# Altium schematic sheet PAGE2-Incubator_HUZZAH32.SchDoc
size A3
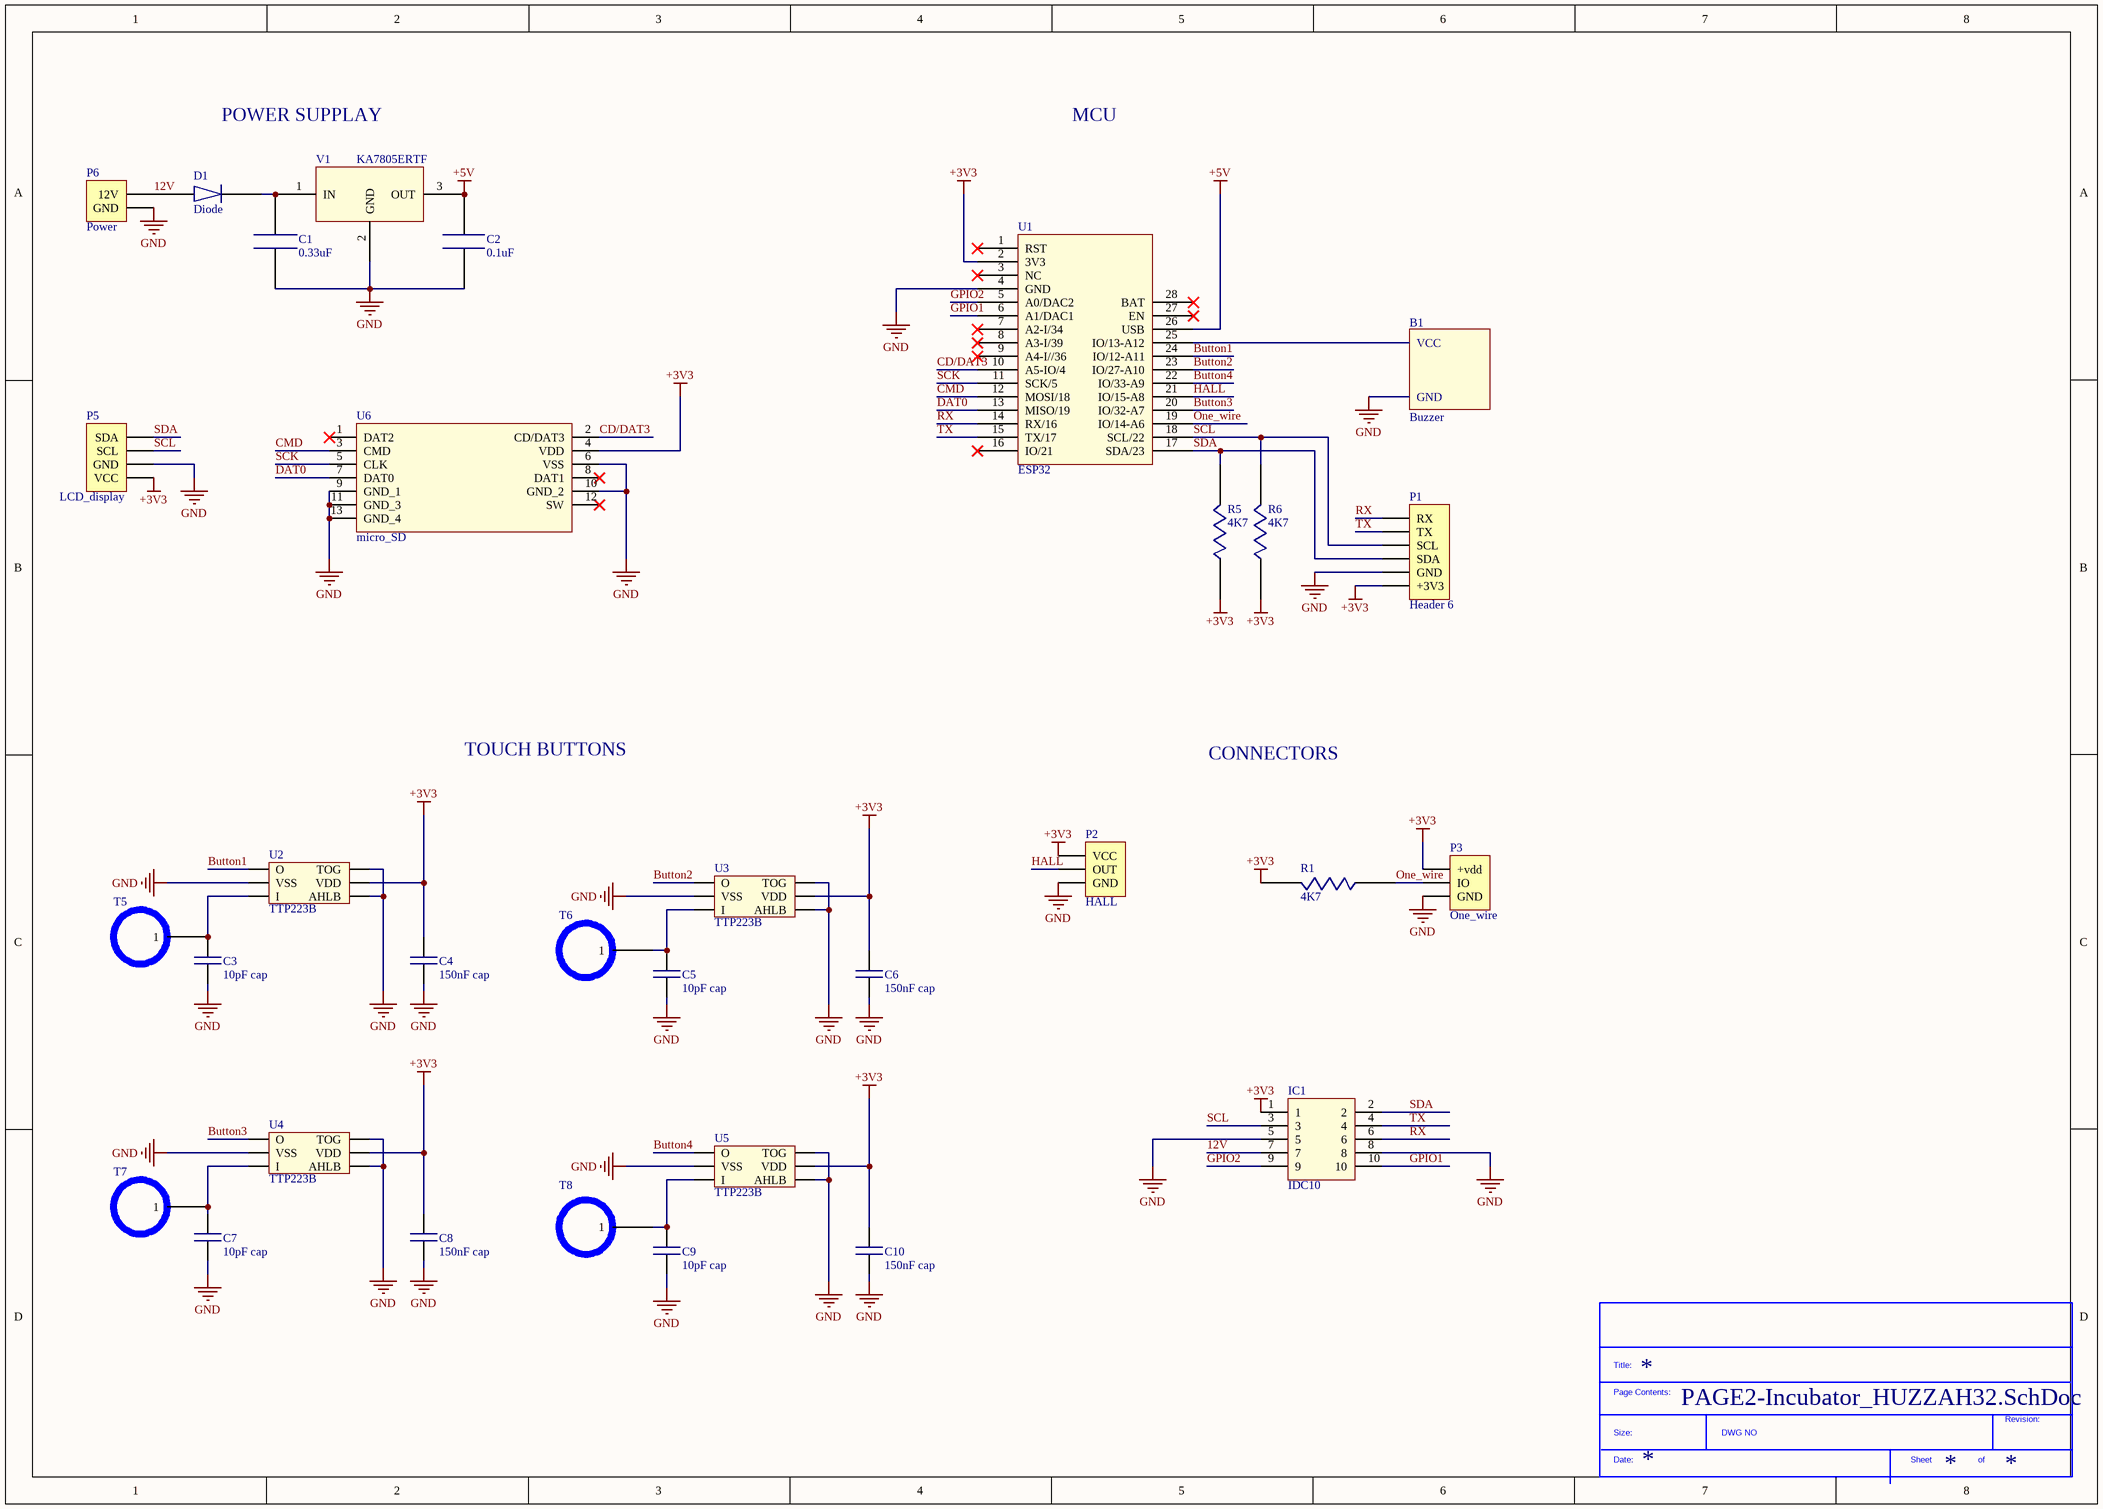
[diagram p0: PAGE2-Incubator_HUZZAH32.SchDoc]

## Parts
*?  SDTitleBlock  (value not drawn)  (graphical)
B1  Buzzer  [Buzzer]
C1  0.33uF  [CAP0603]
C2  0.1uF  [CAP0603]
C3  10pF cap  [CAP0603]
C4  150nF cap  [CAP0603]
C5  10pF cap  [CAP0603]
C6  150nF cap  [CAP0603]
C7  10pF cap  [CAP0603]
C8  150nF cap  [CAP0603]
C9  10pF cap  [CAP0603]
C10  150nF cap  [CAP0603]
D1  Diode  [SODFL350X110-2N]
IC1  IDC10  [IDC10]
P1  Header 6  [HDR1X6]
P2  HALL  [HDR1X3]
P3  One_wire  [HDR1X3]
P5  LCD_display  [LCD_display]
P6  Power  [HDR1X2]
R1  4K7  [RES0603]
R5  4K7  [RES0603]
R6  4K7  [RES0603]
T5  Touch button  [Touch_Button]  (value not drawn)
T6  Touch button  [Touch_Button]  (value not drawn)
T7  Touch button  [Touch_Button]  (value not drawn)
T8  Touch button  [Touch_Button]  (value not drawn)
U1  ESP32  [ESP32]
U2  TTP223B  [TTP223]
U3  TTP223B  [TTP223]
U4  TTP223B  [TTP223]
U5  TTP223B  [TTP223]
U6  micro_SD  [micro_SD]
V1  KA7805ERTF  [DPAK248P950X240-3N]

## Nets
+3V3: C4.2 C6.2 C8.2 C10.2 IC1.1 P1.6(+3V3) P2.1(VCC) P3.1(+vdd) P5.1(VCC) R1.2 R5.1 R6.1 U1.2(3V3) U2.5(VDD) U3.5(VDD) U4.5(VDD) U5.5(VDD) U6.4(VDD)
+5V: C2.2 U1.26(USB) V1.3(OUT)
GND: B1.2(GND) C1.1 C2.1 C3.1 C4.1 C5.1 C6.1 C7.1 C8.1 C9.1 C10.1 IC1.5 IC1.8 P1.5(GND) P2.3(GND) P3.3(GND) P5.2(GND) P6.1(GND) U1.4(GND) U2.2(VSS) U2.4(AHLB) U2.6(TOG) U3.2(VSS) U3.4(AHLB) U3.6(TOG) U4.2(VSS) U4.4(AHLB) U4.6(TOG) U5.2(VSS) U5.4(AHLB) U5.6(TOG) U6.6(VSS) U6.9(GND_1) U6.10(GND_2) U6.11(GND_3) U6.13(GND_4) V1.2(GND)
12V: D1.2 IC1.7 P6.2(12V)
Button1: U1.24(IO/12-A11) U2.1(O)
Button2: U1.23(IO/27-A10) U3.1(O)
Button3: U1.20(IO/32-A7) U4.1(O)
Button4: U1.22(IO/33-A9) U5.1(O)
CD/DAT3: U1.10(A5-IO/4) U6.2(CD/DAT3)
CMD: U1.12(MOSI/18) U6.3(CMD)
DAT0: U1.13(MISO/19) U6.7(DAT0)
GPIO1: IC1.10 U1.6(A1/DAC1)
GPIO2: IC1.9 U1.5(A0/DAC2)
HALL: P2.2(OUT) U1.21(IO/15-A8)
One_wire: P3.2(IO) R1.1 U1.19(IO/14-A6)
RX: IC1.6 P1.1(RX) U1.14(RX/16)
SCK: U1.11(SCK/5) U6.5(CLK)
SCL: IC1.3 P1.3(SCL) P5.3(SCL) R6.2 U1.18(SCL/22)
SDA: IC1.2 P1.4(SDA) P5.4(SDA) R5.2 U1.17(SDA/23)
TX: IC1.4 P1.2(TX) U1.15(TX/17)
NetB1_1: B1.1(VCC) U1.25(IO/13-A12)
NetC1_2: C1.2 D1.1 V1.1(IN)
NetC3_2: C3.2 T5.1 U2.3(I)
NetC5_2: C5.2 T6.1 U3.3(I)
NetC7_2: C7.2 T7.1 U4.3(I)
NetC9_2: C9.2 T8.1 U5.3(I)

Not connected (* = marked no-connect by the designer): U1 1(RST)* 3(NC)* 7(A2-I/34)* 8(A3-I/39)* 9(A4-I//36)* 16(IO/21)* 27(EN)* 28(BAT)*; U6 1(DAT2)* 8(DAT1)* 12(SW)*

## Notes on the sheet
- POWER SUPPLAY
- MCU
- TOUCH BUTTONS
- CONNECTORS
- (in symbol SDTitleBlock) Title:; Page Contents:; Revision:; Size:; DWG NO; Date:; Sheet; of

## Library data of the parts
B1 = Buzzer: MULTICOMP         MCABT-458-RC            SOUNDER, 75DB, 1-25V, SMD; Supply Voltage Min: 1V; Supply Voltage Max: 25V; Tones: Single; Current Rating: 1mA; Resonant Frequency: 4kHz; SVHC: No SVHC (15-Jun-2015); Supplier 1: Farnell; Manufacturer: Multicomp; Manufacturer Part Number: MCABT-458-RC; Stock 1: 2929; Pricing 1: 1=1.84, 3=1.67, 5=1.53, 10=1.44, 20=1.18, 50=1.16, 250=1.13 (EUR); Sound Level SPL: 75dB; Transducer Function: Sounder; Transducer Mounting: SMD; Product Range: -; ComponentLink1URL: http://www.farnell.com/datasheets/1860703.pdf; ComponentLink1Description: http://www.farnell.com/datasheets/1860703.pdf
C1 = 0.33uF: 0.33µF ±10% 50V X7R Ceramic Capacitor -55°C ~ 125°C Surface Mount, MLCC 0603 (1608 Metric) 0.063" L x 0.031" W (1.60mm x 0.80mm); Manufacturer: TDK; Manufacturer Part Number: C1608X7R1H334K080AC; PCN Part Number: MLCC Part Number Change 30/Nov/2012; Product Training Modules: C Series General Applications SEAT, CCV, and TVCL Design Tools Guide to Replacing an Electrolytic Capacitor with an MLCC; Catalog Drawings: C SERIES_0603_0.95; Design Resources: 20 W Non-Isolated Buck LED Driver Using PL LNK460KG; EDA / CAD Models: Download from Accelerated Designs; Online Catalog: C Series, General Purpose; Other Names: 445-5950-6; Supplier 1: Farnell; Stock 1: 46003; Pricing 1: 10=0.405, 100=0.221, 500=0.152, 1000=0.116 (EUR); RoHS Information: RoHS Certificate-MLCC; Standard Package: 1; Category: Capacitors; Family: Ceramic Capacitors; Series: C; Packaging: Digi-Reel®; Capacitance: 0.33µF; Tolerance: ±10%; Voltage - Rated: 50V; Temperature Coefficient: X7R; Mounting Type: Surface Mount, MLCC; Operating Temperature: -55°C ~ 125°C; Applications: General Purpose; Package / Case: 0603 (1608 Metric); Size / Dimension: 0.063" L x 0.031" W (1.60mm x 0.80mm); Thickness (Max): 0.037" (0.95mm); Supplier Part Number 1: 2346907
C2 = 0.1uF: CAP CER 0.1UF 50V X7R 0603; Manufacturer: KEMET; Manufacturer Part Number: C0603C104J5RACAUTO; Capacitance: .1uF; Tolerance (+ or -): 5%; Voltage: 50VDC; Case Style: Ceramic Chip; Wire Form: Not Required; Product Length (mm): 1.6mm; Product Depth (mm): 0.8mm; Product Diameter (mm): Not Requiredmm; Supplier 1: Farnell; Stock 1: 0; Package / Case: 0603; Packaging: Tape and Reel; Supplier Part Number 1: 2478241; Temp Coeff (Dielectric): X7R; Operating Temp Range: -55C to 125C; Mounting Style: Surface Mount; Construction: SMT Chip; Failure Rate: Not Required; Product Height (mm): 0.8mm
C3 C5 C7 C9 = 10pF: Cap Ceramic 10pF 50V X7R 10% SMD 0603 125C T/R; Manufacturer: Kyocera AVX; Manufacturer Part Number: 06035C100KAT2A; Supplier 1: Farnell; Stock 1: 0; Capacitance: 10 pF; Case Size/Dimension: 0603; Dielectric: X7R; Tolerance (%): ±10 %; Rated Voltage: 50 V; Supplier Part Number 1: 2332633
C4 C6 C8 C10 = 150nF: Manufacturer: KEMET; Manufacturer Part Number: C0603C154K5RACAUTO; Capacitance: .15uF; Tolerance (+ or -): 10%; Voltage: 50VDC; Temp Coeff (Dielectric): X7R; Case Style: Ceramic Chip; Wire Form: Not Required; Product Length (mm): 1.6mm; Product Depth (mm): 0.8mm; Product Diameter (mm): Not Requiredmm; Supplier 1: Farnell; Supplier Part Number 1: 2821222; Stock 1: 3690; Pricing 1: 10=0.125, 100=0.0664, 500=0.0489, 1000=0.041 (EUR); Operating Temp Range: -55C to 125C; Mounting Style: Surface Mount; Package / Case: 0603; Construction: SMT Chip; Failure Rate: Not Required; Product Height (mm): 0.8mm; Packaging: Tape and Reel
D1 = 20V,1A, SOD-123: NXP         PMEG2010ER             Schottky Rectifier, Single, 20 V, 1 A, SOD-123W, 2 Pins, 340 mV; Manufacturer: NXP Semiconductors; Maximum Continuous Forward Current: 1A; Number of Elements per Chip: 1; Peak Reverse Repetitive Voltage: 20V; Peak Forward Voltage: 340mV; Peak Reverse Current: 1mA; Supplier 1: Farnell; Manufacturer Part Number: PMEG2010ER; Stock 1: 5091; Pricing 1: 5=0.314, 25=0.196, 100=0.147, 250=0.141, 500=0.0849, 1000=0.075, 5000=0.0735 (EUR); Diode Configuration: Single; Mounting Type: Surface Mount; Package Type: SOD-123; Diode Type: Schottky; Pin Count: 2; Length: 2.8mm; Width: 1.9mm; Height: 1.1mm; Dimensions: 2.8 x 1.9 x 1.1mm; Maximum Operating Temperature: +150 °C; Minimum Operating Temperature: -55 °C; ComponentLink1URL: https://datasheet.ciiva.com/5727/1760771-5727088.pdf; ComponentLink1Description: https://datasheet.ciiva.com/5727/1760771-5727088.pdf; ComponentLink2URL: https://datasheet.ciiva.com/22696/1383341-22696483.pdf; ComponentLink2Description: https://datasheet.ciiva.com/22696/1383341-22696483.pdf; ComponentLink3URL: https://datasheet.ciiva.com/7965/1383341-7965062.pdf; ComponentLink3Description: https://datasheet.ciiva.com/7965/1383341-7965062.pdf; Supplier Part Number 1: 1907681
IC1 = IDC10: BOX HEADER 2.54MM MALE STR 10POS; Manufacturer: Wurth Electronics; Manufacturer Part Number: 61201021621; Number of Positions: 10 Position; Mounting Angle: Horizontal; Current Rating: 3 A; Insulation Resistance: 1000 MOhms; Voltage Rating: 250 V; Supplier 1: Farnell; Stock 1: 0; Product Category: Headers & Wire Housings; RoHS: True; Product: Headers; Type: Shrouded; Pitch: 2.54 mm; Number of Rows: 2 Row; Mounting Style: Through Hole; Termination Style: Solder; Contact Gender: Pin (Male); Contact Plating: Gold; Series: WR-BHD; Application: Wire-to-Board; Brand: Wurth Electronics; Contact Material: Copper Alloy; Flammability Rating: UL 94 V-0; Housing Material: Polybutylene Terephthalate (PBT); Operating Temperature Range: - 40 C to + 125 C; Packaging: Tray; ComponentLink1URL: https://datasheet.ciiva.com/731/6120xx21621-731344.pdf; ComponentLink1Description: https://datasheet.ciiva.com/731/6120xx21621-731344.pdf; ComponentLink2URL: https://datasheet.ciiva.com/15395/6120xx21621-265834-15395106.pdf; ComponentLink2Description: https://datasheet.ciiva.com/15395/6120xx21621-265834-15395106.pdf; ComponentLink3URL: https://datasheet.ciiva.com/7648/76595-7648121.pdf; ComponentLink3Description: https://datasheet.ciiva.com/7648/76595-7648121.pdf; Supplier Part Number 1: 1642019
P1 = Header 6: Header, 6-Pin; LatestRevisionDate: 17-Jul-2002; LatestRevisionNote: Re-released for DXP Platform.; Publisher: Altium Limited
P2 P3 = Header 3: Header, 3-Pin; LatestRevisionDate: 17-Jul-2002; LatestRevisionNote: Re-released for DXP Platform.; Publisher: Altium Limited
P5 = Header 4: Header, 4-Pin; LatestRevisionDate: 17-Jul-2002; LatestRevisionNote: Re-released for DXP Platform.; Publisher: Altium Limited
P6 = Header 2: Header, 2-Pin; LatestRevisionDate: 17-Jul-2002; LatestRevisionNote: Re-released for DXP Platform.; Publisher: Altium Limited
R1 R5 R6 = 4K7: Res Thick Film 0603 4.7K Ohm 1% 0.1W(1/10W) ±100ppm/C Molded SMD Automotive T/R; Manufacturer: Panasonic; Manufacturer Part Number: ERJ-3EKF4701V; Resistance: 4.7 kOhms; Power Rating: 100 mW; Voltage Rating: 75 V; Qualification: AEC-Q200; Unit Weight: 0.000071 oz; Supplier 1: Farnell; Stock 1: 3193; Pricing 1: 10=0.0347, 100=0.0206, 500=0.0159, 1000=0.0142 (GBP); Product Category: Thick Film Resistors; RoHS: True; Tolerance: 1 %; Case Code - in: 0603; Temperature Coefficient: 100 PPM / C; Case Code - mm: 1608; Operating Temperature Range: - 55 C to + 155 C; Series: ERJ; Type: Precision Thick Film Resistors SMD; Brand: Panasonic; Height: 0.45 mm; Length: 1.6 mm; Package / Case: 0603 (1608 metric); Packaging: Reel; Product: Thick Film Resistors SMD; Factory Pack Quantity: 5000; Termination Style: SMD/SMT; Width: 0.8 mm; Supplier Part Number 1: 2303181
U1 = 3405: Dip connectro for MCU; Manufacturer: Adafruit Industries; Supplier 1: Digi-Key; Manufacturer Part Number: 3405; Stock 1: 276; Pricing 1: 1=19.95 (USD); ComponentLink1URL: https://espressif.com/sites/default/files/documentation/esp32_datasheet_en.pdf; ComponentLink1Description: https://espressif.com/sites/default/files/documentation/esp32_datasheet_en.pdf; Supplier Part Number 1: 1528-2181-ND
U2-U5 = Touch_Sensor
U6 = micro_SD: Manufacturer: Hirose; Manufacturer Part Number: DM3CS-SF; Product Training Modules: DM3 Series microSD Card Sockets; Featured Product: DM3CS Connector; HTML Datasheet: DM3 Series microSD.html; Card Type: Secure Digital - microSD™; Number of Positions: 10 (8 + 2); Connector Type: Connector and Ejector; Insertion, Removal Method: Hinged Lid; Online Catalog: DM3 Series; Other Names: HR1972DKR; Supplier 1: Farnell; Stock 1: 15420; Pricing 1: 1=0.967, 50=0.925, 100=0.883, 250=0.798, 500=0.735, 1000=0.494 (GBP); Standard Package: 1; Category: Connectors, Interconnects; Family: Memory Connectors - PC Card Sockets; Series: DM3; Packaging: Digi-Reel®; Ejector Side: -; Mounting Type: Surface Mount, Right Angle; Features: Switch; Height Above Board: 0.072" (1.83mm); Mounting Feature: Normal, Standard - Top; Contact Finish: Gold; Contact Finish Thickness: -; ComponentLink1URL: https://datasheet.ciiva.com/683/e60900232-683360.pdf; ComponentLink1Description: https://datasheet.ciiva.com/683/e60900232-683360.pdf; ComponentLink2URL: https://datasheet.ciiva.com/683/e60900232-683361.pdf; ComponentLink2Description: https://datasheet.ciiva.com/683/e60900232-683361.pdf; ComponentLink3URL: https://datasheet.ciiva.com/7651/1465328-7651895.pdf; ComponentLink3Description: https://datasheet.ciiva.com/7651/1465328-7651895.pdf; ComponentLink4URL: https://datasheet.ciiva.com/3122/e60900232-3122536.pdf; ComponentLink4Description: https://datasheet.ciiva.com/3122/e60900232-3122536.pdf; ComponentLink5URL: https://datasheet.ciiva.com/4581/e60900232-38395-4581034.pdf; ComponentLink5Description: https://datasheet.ciiva.com/4581/e60900232-38395-4581034.pdf; ComponentLink6URL: https://datasheet.ciiva.com/16434/e60900232-16434058.pdf; ComponentLink6Description: https://datasheet.ciiva.com/16434/e60900232-16434058.pdf; ComponentLink7URL: https://datasheet.ciiva.com/16655/e60900232-16655644.pdf; ComponentLink7Description: https://datasheet.ciiva.com/16655/e60900232-16655644.pdf; ComponentLink8URL: https://datasheet.ciiva.com/683/e60900232-683359.pdf; ComponentLink8Description: https://datasheet.ciiva.com/683/e60900232-683359.pdf; Supplier Part Number 1: 1764376
V1 = 5-20V: FAIRCHILD SEMICONDUCTOR         KA7805ERTF             Linear Voltage Regulator, 7805, Fixed, 10V To 35V In, 5V And 1A Out, TO-252-3; Manufacturer: ON Semiconductor / Fairchild; Minimum Input Voltage: 7 V; Maximum Input Voltage: 25 V; Number of Outputs: 1; Polarity: Positive; Typical Dropout Voltage @ Current: 2 V @ 1 A; Quiescent Current: 8mA; Load Regulation: 100 mV; Supplier 1: Farnell; Manufacturer Part Number: KA7805ERTF; Stock 1: 0; Output Voltage: 5 V; Maximum Output Current: 1A; Package Type: DPAK; Output Type: Fixed; Mounting Type: Surface Mount; Regulator Function: Linear; Pin Count: 3; Minimum Operating Temperature: 0 °C; Maximum Operating Temperature: +125 °C; Series: KA78xx; Height: 2.38mm; Width: 6.22mm; Dropout Voltage Measurement Current: 1 A; Dimensions: 6.73 x 6.22 x 2.38mm; Length: 6.73mm; Line Regulation: 100 mV; Supplier Part Number 1: 2102585; Pricing 1: 1=0.793, 50=0.693, 100=0.447 (GBP)